# Altium schematic sheet [5] Peripheral_Module.SchDoc
size A4; Organization: UNMEI ELECTRICAL; Address1: 16B/12 Nguyen Du Street; Address2: Da Lat City, LD Province; SheetNumber: 5; SheetTotal: 7
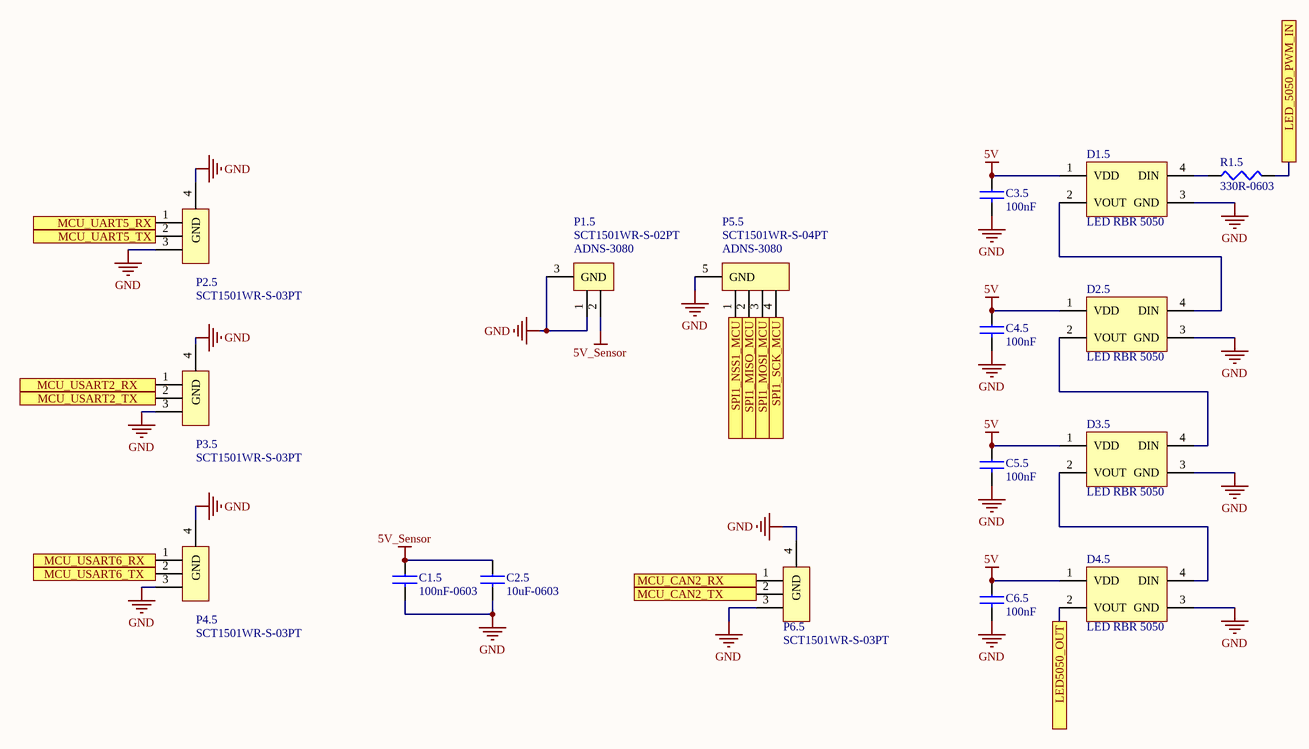
[diagram p0: [5] Peripheral_Module.SchDoc]

## Parts
C1.5  100nF-0603  [CAP0603]
C2.5  10uF-0603  [CAP0603]
C3.5  100nF  [CAP0603]
C4.5  100nF  [CAP0603]
C5.5  100nF  [CAP0603]
C6.5  100nF  [CAP0603]
D1.5  LED RBR 5050  [LED RGB  5050]
D2.5  LED RBR 5050  [LED RGB  5050]
D3.5  LED RBR 5050  [LED RGB  5050]
D4.5  LED RBR 5050  [LED RGB  5050]
P1.5  SCT1501WR-S-02PT  [Connector ZH1.5 2P SMD]
P2.5  SCT1501WR-S-03PT  [Connector ZH1.5 3P SMD]
P3.5  SCT1501WR-S-03PT  [Connector ZH1.5 3P SMD]
P4.5  SCT1501WR-S-03PT  [Connector ZH1.5 3P SMD]
P5.5  SCT1501WR-S-04PT  [Connector ZH1.5 4P SMD]
P6.5  SCT1501WR-S-03PT  [Connector ZH1.5 3P SMD]
R1.5  330R-0603  [RES0603 - 3D]

## Ports
LED5050_OUT, LED_5050_PWM_IN, MCU_CAN2_RX, MCU_CAN2_TX, MCU_UART5_RX, MCU_UART5_TX, MCU_USART2_RX, MCU_USART2_TX, MCU_USART6_RX, MCU_USART6_TX, SPI1_MISO_MCU, SPI1_MOSI_MCU, SPI1_NSS1_MCU, SPI1_SCK_MCU

## Nets
5V: C3.5.1 C4.5.1 C5.5.1 C6.5.1 D1.5.1(VDD) D2.5.1(VDD) D3.5.1(VDD) D4.5.1(VDD)
5V_Sensor: C1.5.1 C2.5.1 P1.5.2
GND: C1.5.2 C2.5.2 C3.5.2 C4.5.2 C5.5.2 C6.5.2 D1.5.3(GND) D2.5.3(GND) D3.5.3(GND) D4.5.3(GND) P1.5.1 P1.5.3(GND) P2.5.3 P2.5.4(GND) P3.5.3 P3.5.4(GND) P4.5.3 P4.5.4(GND) P5.5.5(GND) P6.5.3 P6.5.4(GND)
LED5050_OUT: D4.5.2(VOUT) ; port LED5050_OUT
LED_5050_PWM_IN: R1.5.2 ; port LED_5050_PWM_IN
MCU_CAN2_RX: P6.5.1 ; port MCU_CAN2_RX
MCU_CAN2_TX: P6.5.2 ; port MCU_CAN2_TX
MCU_UART5_RX: P2.5.1 ; port MCU_UART5_RX
MCU_UART5_TX: P2.5.2 ; port MCU_UART5_TX
MCU_USART2_RX: P3.5.1 ; port MCU_USART2_RX
MCU_USART2_TX: P3.5.2 ; port MCU_USART2_TX
MCU_USART6_RX: P4.5.1 ; port MCU_USART6_RX
MCU_USART6_TX: P4.5.2 ; port MCU_USART6_TX
SPI1_MISO_MCU: P5.5.2 ; port SPI1_MISO_MCU
SPI1_MOSI_MCU: P5.5.3 ; port SPI1_MOSI_MCU
SPI1_NSS1_MCU: P5.5.1 ; port SPI1_NSS1_MCU
SPI1_SCK_MCU: P5.5.4 ; port SPI1_SCK_MCU
NetD1.5_2: D1.5.2(VOUT) D2.5.4(DIN)
NetD1.5_4: D1.5.4(DIN) R1.5.1
NetD2.5_2: D2.5.2(VOUT) D3.5.4(DIN)
NetD3.5_2: D3.5.2(VOUT) D4.5.4(DIN)

## Notes on the sheet
- (near P1.5) ADNS-3080
- (near P5.5) ADNS-3080
- Title
- Size:
- Date:
- Author:
- A4
- Time:
- Number:
- Checked:
- Revision:
- Sheet
- Approved:
- of
- https://unmeiongaku.moe/
- +84 337624412
- File:

## Library data of the parts
C1.5 = CC0603KRX7R9BB104: CAP CER 0.1UF 50V X7R 0603; Manufacturer 1: Yageo; Category 1: Capacitors; Capacitance: 0.1µF; Tolerance: ±10%; Value: 100nF; Supplier 1: Digi-Key; Supplier Part Number 1: 311-1344-1-ND; Manufacturer Part Number 1: CC0603KRX7R9BB104; RoHS 1: RoHS Compliant; Description 1: CAP CER 0.1UF 50V X7R 0603; Stock 1: 4411645; Pricing 1: 1=0.1, 10=0.031, 100=0.014, 500=0.00998, 1000=0.00783 (USD); Packaging: Cut Tape (CT); Part Status: Active; Voltage - Rated: 50V; Temperature Coefficient: X7R; Operating Temperature: -55°C ~ 125°C; Features: -; Ratings: -; Applications: General Purpose; Failure Rate: -; Mounting Type: Surface Mount, MLCC; Package / Case: 0603 (1608 Metric); Size / Dimension: 0.063" L x 0.031" W (1.60mm x 0.80mm); Height - Seated (Max): -; Thickness (Max): 0.035" (0.90mm); Lead Spacing: -; Lead Style: -; ComponentLink1URL: http://www.yageo.com/documents/recent/UPY-GPHC_X7R_6.3V-to-50V_18.pdf; ComponentLink1Description: http://www.yageo.com/documents/recent/UPY-GPHC_X7R_6.3V-to-50V_18.pdf
C2.5 = CC0603KRX5R6BB106: CAP CER 10UF 10V X5R 0603; Manufacturer 1: Yageo; Category 1: Capacitors; Capacitance: 10µF; Tolerance: ±10%; Supplier 1: Digi-Key; Supplier Part Number 1: 311-1782-1-ND; Manufacturer Part Number 1: CC0603KRX5R6BB106; RoHS 1: RoHS Compliant; Description 1: CAP CER 10UF 10V X5R 0603; Stock 1: 66566; Pricing 1: 1=0.33, 10=0.225, 100=0.1272, 500=0.08982, 1000=0.07858 (USD); Packaging: Cut Tape (CT); Part Status: Active; Voltage - Rated: 10V; Temperature Coefficient: X5R; Operating Temperature: -55°C ~ 85°C; Features: -; Ratings: -; Applications: General Purpose; Failure Rate: -; Mounting Type: Surface Mount, MLCC; Package / Case: 0603 (1608 Metric); Size / Dimension: 0.063" L x 0.031" W (1.60mm x 0.80mm); Height - Seated (Max): -; Thickness (Max): 0.035" (0.90mm); Lead Spacing: -; Lead Style: -; ComponentLink1URL: http://www.yageo.com/documents/recent/UPY-GPHC_X5R_4V-to-50V_24.pdf; ComponentLink1Description: http://www.yageo.com/documents/recent/UPY-GPHC_X5R_4V-to-50V_24.pdf; Value: 10uF
C3.5 C4.5 C5.5 C6.5 = CC0603KRX7R0BB104: CAP CER 0.1UF 100V X7R 0603; Manufacturer: Yageo; Tolerance: ±10%; Supplier 1: Digi-Key; Manufacturer Part Number: CC0603KRX7R0BB104; RoHS: RoHS Compliant; Category: Capacitors; Stock 1: 784508; Pricing 1: 1=0.23, 10=0.156, 100=0.0791, 500=0.05414, 1000=0.0479 (USD); Packaging: Cut Tape (CT); Part Status: Active; Temperature Coefficient: X7R; Operating Temperature: -55°C ~ 125°C; Features: -; Ratings: -; Applications: General Purpose; Failure Rate: -; Mounting Type: Surface Mount, MLCC; Package / Case: 0603 (1608 Metric); Size / Dimension: 0.063" L x 0.032" W (1.60mm x 0.80mm); Height - Seated (Max): -; Thickness (Max): 0.035" (0.90mm); Lead Spacing: -; Lead Style: -; ComponentLink1URL: http://media.digikey.com/pdf/Data%20Sheets/Yageo%20PDFs/NPO,%20X7R%20Mid-voltage.pdf; ComponentLink1Description: http://media.digikey.com/pdf/Data%20Sheets/Yageo%20PDFs/NPO,%20X7R%20Mid-voltage.pdf; Supplier Part Number 1: 311-1523-1-ND; Value: 100nF; Voltage - Rated: 100V
D1.5 D2.5 D3.5 D4.5 = LED RBR 5050 - IN-PI55QATPRPGPBPW-60: Address Led Discrete Serial Rgbw; Manufacturer: Inolux; Color: White,Blue,Green,Red; Lens Style: Round,Flat; Luminous Intensity: 1850mcd; Forward Voltage: 5.2V; Test Current: 12mA; Dominant Wavelength: 465nm; Supplier 1: Arrow Electronics; Manufacturer Part Number: IN-PI55QATPRPGPBPW-60; RoHS: No; Category: LEDs; Stock 1: 964; Pricing 1: 1=0.71450, 10=0.46990, 25=0.46520, 100=0.30470, 250=0.30220, 500=0.29430 (USD); Mount: Surface Mount; Case/Package: SMD/SMT; Packaging: Tape and Reel; Length: 5mm; Width: 5mm; Height: 1.7mm; ComponentLink1URL: http://www.inolux-corp.com/datasheet/SMDLED/Addressable%20LED/IN-PI55QATPRPGPBPW-XX_v1.2.pdf?src-supplier=Digi-Key; ComponentLink1Description: http://www.inolux-corp.com/datasheet/SMDLED/Addressable%20LED/IN-PI55QATPRPGPBPW-XX_v1.2.pdf?src-supplier=Digi-Key; Supplier Part Number 1: IN-PI55QATPRPGPBPW-60
R1.5 = RC0603JR-07330RL: RES SMD 330 OHM 5% 1/10W 0603; Manufacturer 1: Yageo; Category 1: Resistors; Resistance (Ohms): 330; Power (Watts): 0.1W, 1/10W; Temperature Coefficient: ±100ppm/°C; Value: 330R; Supplier 1: Digi-Key; Supplier Part Number 1: 311-330GRCT-ND; Manufacturer Part Number 1: RC0603JR-07330RL; RoHS 1: RoHS Compliant; Description 1: RES SMD 330 OHM 5% 1/10W 0603; Stock 1: 1463213; Pricing 1: 1=0.1, 10=0.011, 100=0.0046, 1000=0.00207, 2500=0.0018 (USD); Packaging: Cut Tape (CT); Part Status: Active; Tolerance: ±5%; Composition: Thick Film; Features: Moisture Resistant; Operating Temperature: -55°C ~ 155°C; Package / Case: 0603 (1608 Metric); Supplier Device Package: 0603; Size / Dimension: 0.063" L x 0.031" W (1.60mm x 0.80mm); Height - Seated (Max): 0.022" (0.55mm); Failure Rate: -; ComponentLink1URL: http://www.yageo.com/documents/recent/PYu-RC_Group_51_RoHS_L_7.pdf; ComponentLink1Description: http://www.yageo.com/documents/recent/PYu-RC_Group_51_RoHS_L_7.pdf